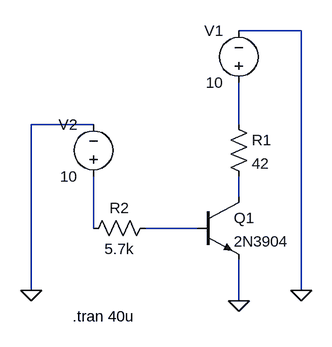
[diagram p0: schematic BJT.asc]
BJT.asc, the LTspice schematic file:
Version 4
SHEET 1 880 680
WIRE 272 32 176 32
WIRE -48 176 -144 176
WIRE 176 176 176 112
WIRE 176 288 176 256
WIRE -48 336 -48 256
WIRE 112 336 32 336
WIRE -144 432 -144 176
WIRE 272 432 272 32
WIRE 176 448 176 384
FLAG 176 448 0
FLAG -144 432 0
FLAG 272 432 0
SYMBOL res 160 160 R0
SYMATTR InstName R1
SYMATTR Value 42
SYMBOL npn 112 288 R0
SYMATTR InstName Q1
SYMATTR Value 2N3904
SYMBOL res 48 320 R90
WINDOW 0 0 56 VBottom 2
WINDOW 3 32 56 VTop 2
SYMATTR InstName R2
SYMATTR Value 5.7k
SYMBOL voltage 176 128 R180
WINDOW 0 24 96 Left 2
WINDOW 3 24 16 Left 2
WINDOW 123 0 0 Left 0
WINDOW 39 0 0 Left 0
SYMATTR InstName V1
SYMATTR Value 10
SYMBOL voltage -48 272 R180
WINDOW 0 24 96 Left 2
WINDOW 3 24 16 Left 2
WINDOW 123 0 0 Left 0
WINDOW 39 0 0 Left 0
SYMATTR InstName V2
SYMATTR Value 10
TEXT -80 472 Left 2 !.tran 40u

The netlist it stands for:
* BJT.asc
R1 N001 N002 42
Q1 N002 N004 0 0 2N3904
R2 N004 N003 5.7k
V1 N001 0 10
V2 N003 0 10
.model NPN NPN
.model PNP PNP
.lib standard.bjt
.tran 40u
.backanno
.end